# EAGLE design TSOC_GROVEY_WIFI_R0_9 (EAGLE 6.6.0)
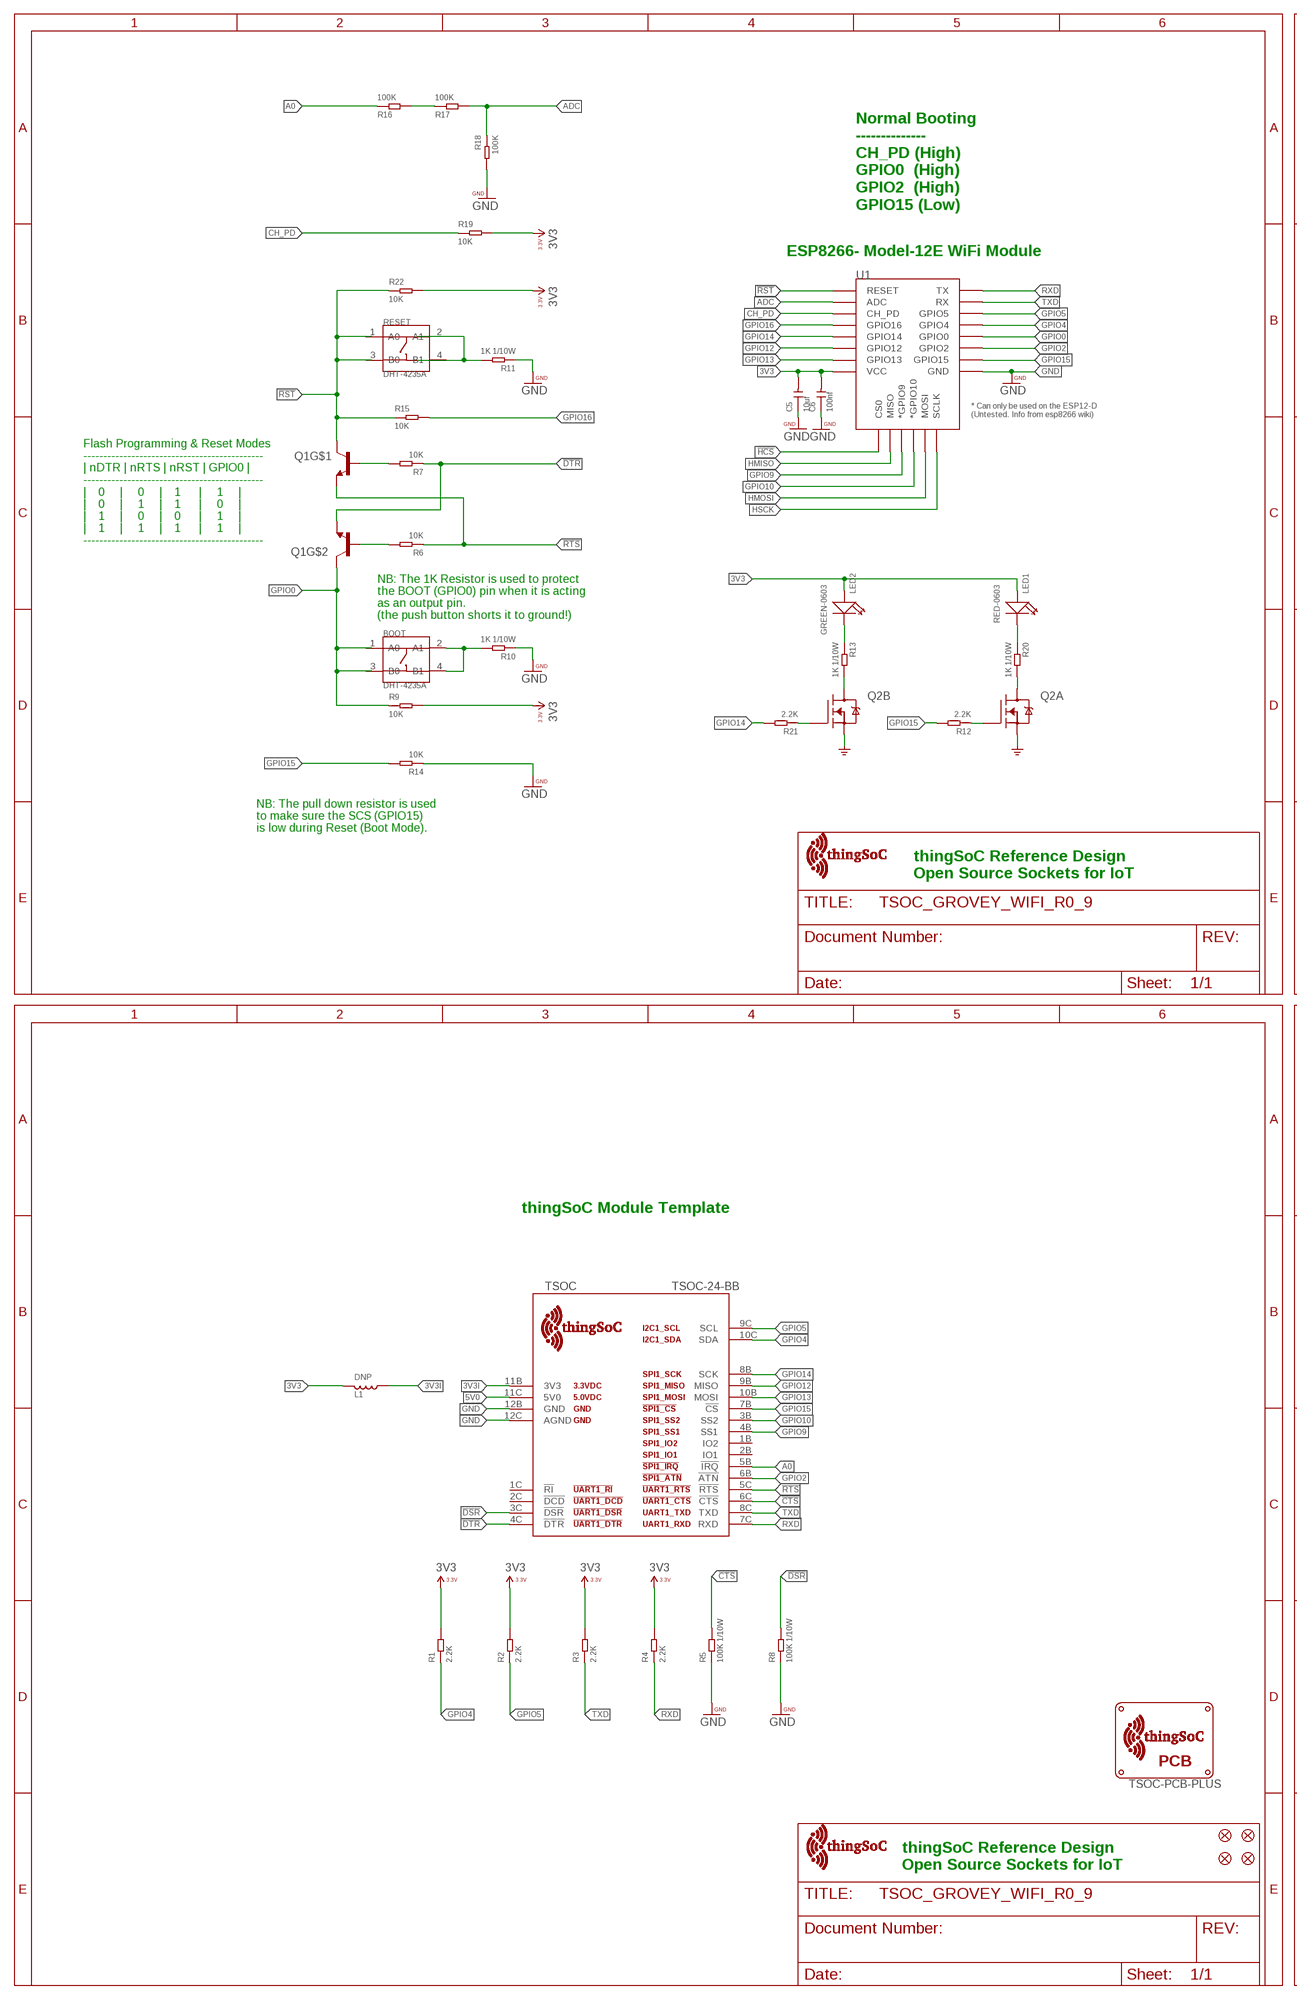
[diagram p0: schematic, sheet 1, part 1 of 2]
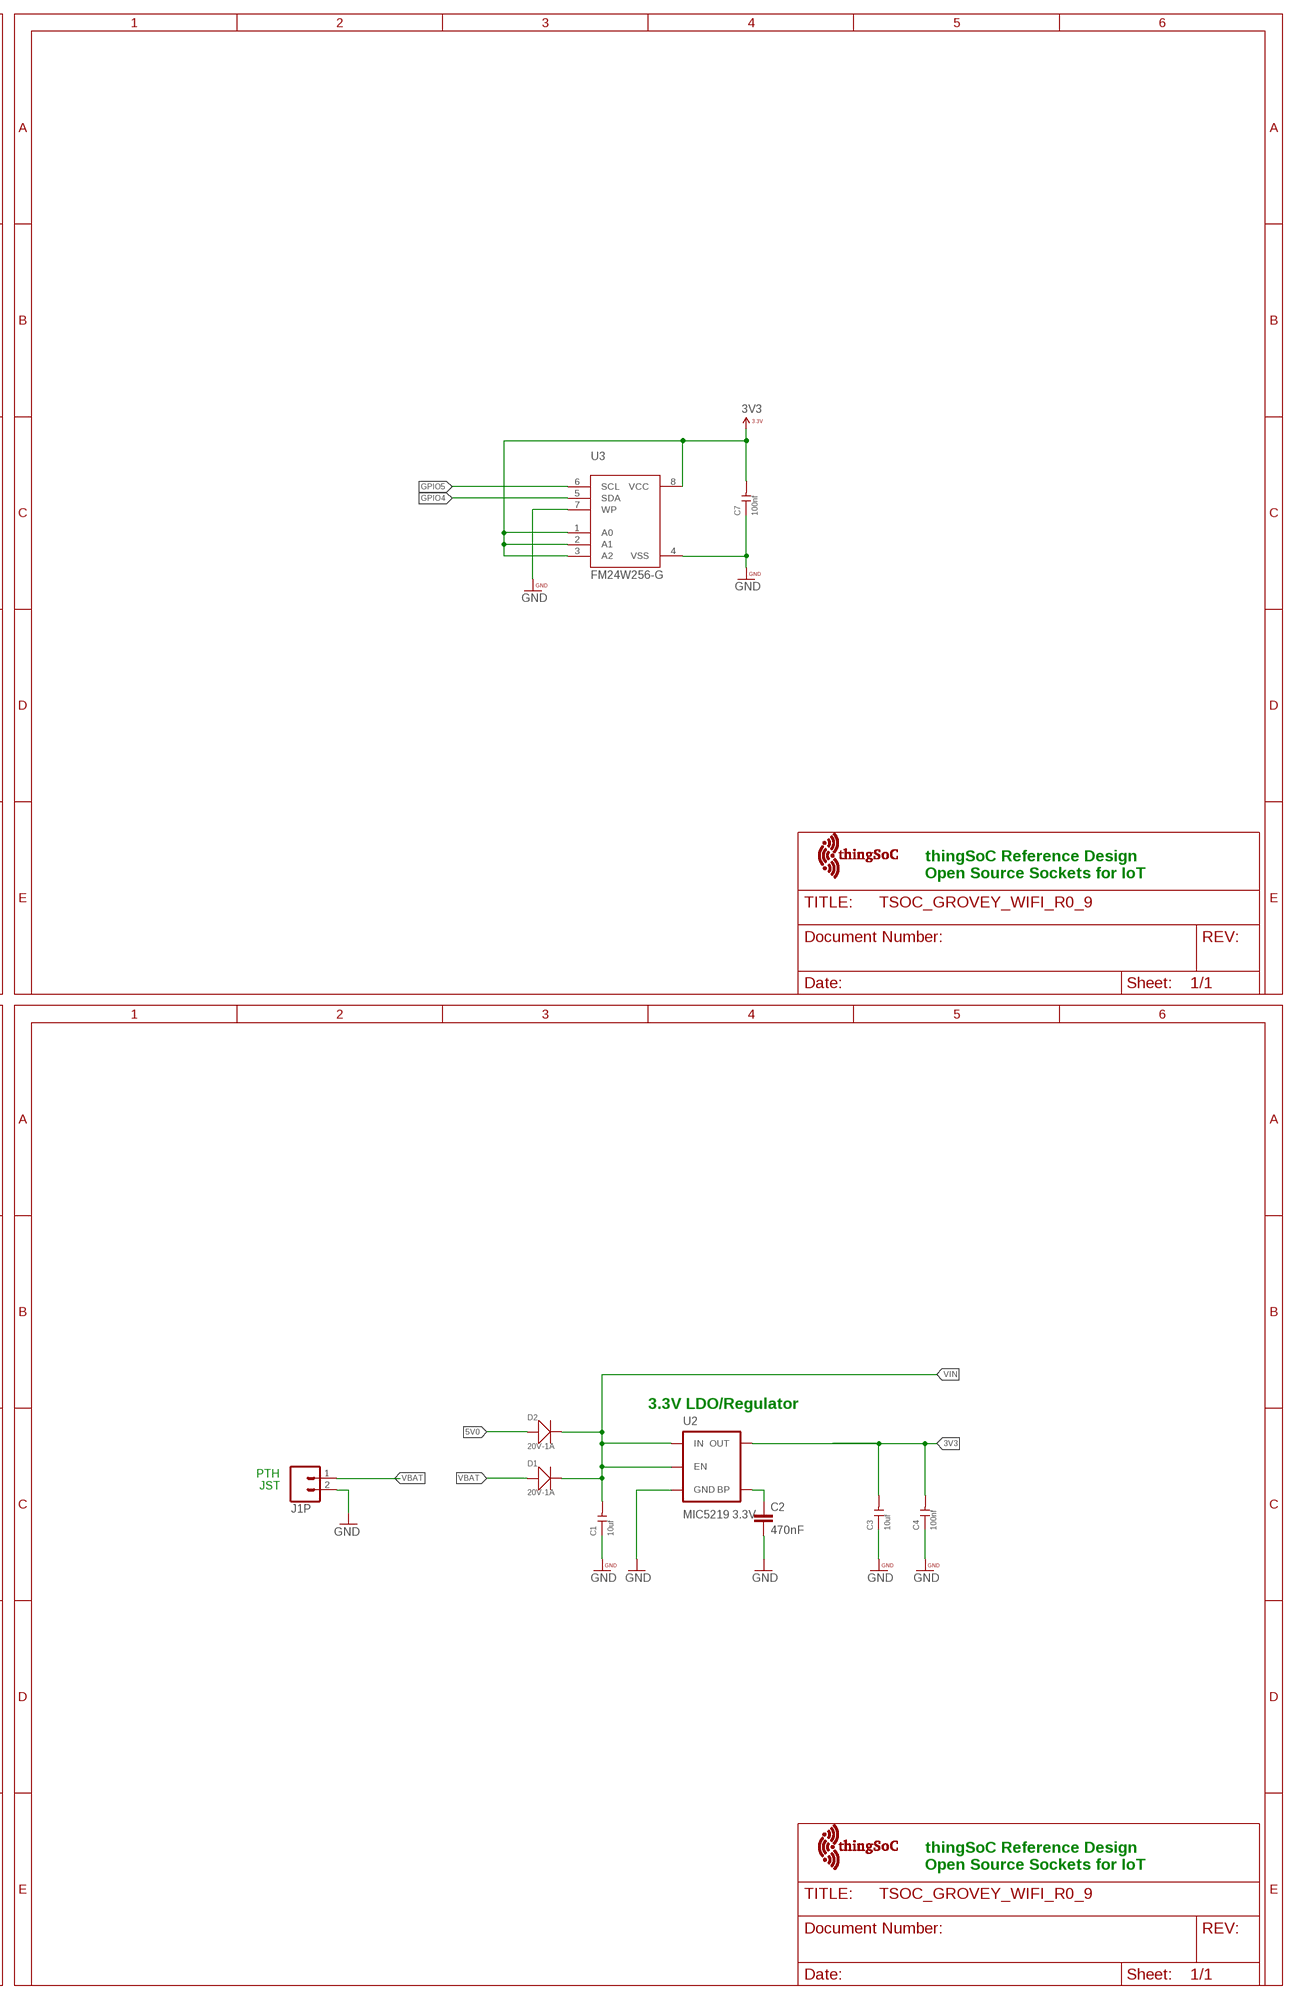
[diagram p1: schematic, sheet 1, part 2 of 2]

## Parts
BOOT  DHT-4235A  SMD-BUTTON-TOP-DHT-4235A(4P-4.2X3.2MM)  [SW4-SMD-4.2X3.2X2.5MM]
C1  10uf  CERAMIC-10UF-25V-10%-X5R(1206)  [C1206]
C2  470nF  CAP0402-CAP  [0402-CAP]
C3  10uf  CERAMIC-10UF-25V-10%-X5R(1206)  [C1206]
C4  100nf  CERAMIC-100NF-50V-10%-X7R(0603)  [C0603]
C5  10uf  CERAMIC-10UF-25V-10%-X5R(1206)  [C1206]
C6  100nf  CERAMIC-100NF-50V-10%-X7R(0603)  [C0603]
C7  100nf  CERAMIC-100NF-50V-10%-X7R(0603)  [C0603]
D1  20V-1A  SMD-DIODE-SCHOTTKY-20V-1A(SOD-123)  [SOD-123]
D2  20V-1A  SMD-DIODE-SCHOTTKY-20V-1A(SOD-123)  [SOD-123]
FID1  FIDUCIALUFIDUCIAL  [MICRO-FIDUCIAL]
FID2  FIDUCIALUFIDUCIAL  [MICRO-FIDUCIAL]
FID3  FIDUCIALUFIDUCIAL  [MICRO-FIDUCIAL]
FID4  FIDUCIALUFIDUCIAL  [MICRO-FIDUCIAL]
J1P  M02-JST-2-PTH-NO_SILK  [JST-2-PTH-NS]
L1  DNP  SMD-FERRITE-CHIP-120-OHM-500MA(0603)  [L0603]
LED1  RED-0603  LED-SMD-RED-DIFFUSED(0603)  [LED-0603]
LED2  GREEN-0603  SMD-LED-CLEAR-GREEN(0603)  [LED-0603]
PCB  TSOC-PCB-PLUS  [TSOC-BB-BRD-PLUS-DIM]
Q1  MMBT2222A  MMDT3904  [SOT363]
Q2  FDG1024NZ  [SOT95P280X110-6N]
R1  2.2K  SMD-RES-2.2K-5%-1/10W(0603)  [R0603]
R2  2.2K  SMD-RES-2.2K-5%-1/10W(0603)  [R0603]
R3  2.2K  SMD-RES-2.2K-5%-1/10W(0603)  [R0603]
R4  2.2K  SMD-RES-2.2K-5%-1/10W(0603)  [R0603]
R5  100K 1/10W  SMD-RES-100K-5%-1/10W(0603)  [R0603]
R6  10K  SMD-RES-10K-1%-1/10W(0603)  [R0603]
R7  10K  SMD-RES-10K-1%-1/10W(0603)  [R0603]
R8  100K 1/10W  SMD-RES-100K-5%-1/10W(0603)  [R0603]
R9  10K  SMD-RES-10K-1%-1/10W(0603)  [R0603]
R10  1K 1/10W  SMD-RES-1K-5%-1/10W(0603)  [R0603]
R11  1K 1/10W  SMD-RES-1K-5%-1/10W(0603)  [R0603]
R12  2.2K  SMD-RES-2.2K-5%-1/10W(0603)  [R0603]
R13  1K 1/10W  SMD-RES-1K-5%-1/10W(0603)  [R0603]
R14  10K  SMD-RES-10K-1%-1/10W(0603)  [R0603]
R15  10K  SMD-RES-10K-1%-1/10W(0603)  [R0603]
R16  100K  SMD-RES-100K-1%-1/10W(0603)  [R0603]
R17  100K  SMD-RES-100K-1%-1/10W(0603)  [R0603]
R18  100K  SMD-RES-100K-1%-1/10W(0603)  [R0603]
R19  10K  SMD-RES-10K-1%-1/10W(0603)  [R0603]
R20  1K 1/10W  SMD-RES-1K-5%-1/10W(0603)  [R0603]
R21  2.2K  SMD-RES-2.2K-5%-1/10W(0603)  [R0603]
R22  10K  SMD-RES-10K-1%-1/10W(0603)  [R0603]
RESET  DHT-4235A  SMD-BUTTON-TOP-DHT-4235A(4P-4.2X3.2MM)  [SW4-SMD-4.2X3.2X2.5MM]
TSOC  TSOC-24-BB  [TSOC-BB-S24]
U1  ESP12ESMD  [ESP12E-SMD]
U2  MIC5219 3.3V  V_REG_MIC52193.3V  [SOT23-5]
U3  FM24W256-G  [SO08]
U$22  TSOC-LOGO-MED  [TSOC-LOGO-MED]
U$23  TSOC-LOGO-MED  [TSOC-LOGO-MED]
U$26  TSOC-LOGO-MED  [TSOC-LOGO-MED]
U$28  TSOC-LOGO-MED  [TSOC-LOGO-MED]

## Nets
3V3: C3.2 C4.2 C5.2 C6.2 C7.2 L1.1 LED1.+ LED2.+ R1.2 R2.2 R3.2 R4.2 R9.2 R19.2 R22.2 U1.VCC U2.5(OUT) U3.1(A0) U3.2(A1) U3.3(A2) U3.8(VCC)
3V3I: L1.2 TSOC.11B(3V3)
5V0: D2.+ TSOC.11C(5V0)
!BOOTPD: BOOT.2(A1) BOOT.4(B1) R10.2
!CTS: R5.2 TSOC.6C(!CTS)
!DCDG: Q2.2(A:G) R12.1
!DSR: R8.2 TSOC.3C(!DSR)
!DTR: Q1.1(E) R7.1 TSOC.4C(!DTR)
!HCS: U1.CS0
!RST: Q1.3(C) R15.1 R22.1 RESET.1(A0) RESET.3(B0) U1.RESET
!RSTPD: R11.2 RESET.2(A1) RESET.4(B1)
!RTS: Q1.4(E) R6.1 TSOC.5C(!RTS)
!SCSG: Q2.5(B:G) R21.1
A0: R16.1 TSOC.5B(!IRQ)
ADC: R17.2 R18.1 U1.ADC
ADC2: R16.2 R17.1
BYPASS1: C2.1 U2.4(BP)
CH_PD: R19.1 U1.CH_PD
G0: Q2.6(A:D) R20.2
G15: Q2.3(B:D) R13.2
GND: C1.1 C2.2 C3.1 C4.1 C5.1 C6.1 C7.1 J1P.2 Q2.1(A:S) Q2.4(B:S) R5.1 R8.1 R10.1 R11.1 R14.1 R18.2 TSOC.12B(GND) TSOC.12C(AGND) U1.GND U2.2(GND) U3.4(VSS) U3.7(WP) ; supply symbol labelled GND_POWER
GPIO0: BOOT.1(A0) BOOT.3(B0) Q1.6(C) R9.1 U1.GPIO0
GPIO2: TSOC.6B(!ATN) U1.GPIO2
GPIO4: R1.1 TSOC.10C(SDA) U1.GPIO4 U3.5(SDA)
GPIO5: R2.1 TSOC.9C(SCL) U1.GPIO5 U3.6(SCL)
GPIO9: TSOC.4B(SS1) U1.GPIO9(*GPIO9)
GPIO10: TSOC.3B(SS2) U1.GPIO10(*GPIO10)
GPIO12: TSOC.9B(MISO) U1.GPIO12
GPIO13: TSOC.10B(MOSI) U1.GPIO13
GPIO14: R21.2 TSOC.8B(SCK) U1.GPIO14
GPIO15: R12.2 R14.2 TSOC.7B(!CS) U1.GPIO15
GPIO16: R15.2 U1.GPIO16
HMISO: U1.MISO
HMOSI: U1.MOSI
HSCK: U1.SCLK
LED1: LED2.- R13.1
LED2: LED1.- R20.1
RES: Q1.5(B) R7.2
ROS: Q1.2(B) R6.2
RXD: R4.1 TSOC.7C(RXD) U1.TXD0(TX)
TXD: R3.1 TSOC.8C(TXD) U1.RXD0(RX)
VBAT: D1.+ J1P.1
VIN: C1.2 D1.- D2.- U2.1(IN) U2.3(EN)
Unconnected: TSOC.1B(IO2) TSOC.1C(!RI) TSOC.2B(IO1) TSOC.2C(!DCD)

## Notes on the sheet
- Normal Booting
  --------------
  CH_PD (High)
  GPIO0  (High)
  GPIO2  (High) 
  GPIO15 (Low)
- ESP8266- Model-12E WiFi Module
- Flash Programming & Reset Modes
  ---------------------------------------------
  | nDTR | nRTS | nRST | GPIO0 |
  ---------------------------------------------
  |    0     |     0     |    1      |     1     |
  |    0     |     1     |    1      |     0     |
  |    1     |     0     |    0      |     1     |
  |    1     |     1     |    1      |     1     |
  ---------------------------------------------
- NB: The 1K Resistor is used to protect
  the BOOT (GPIO0) pin when it is acting
  as an output pin.
  (the push button shorts it to ground!)
- NB: The pull down resistor is used 
  to make sure the SCS (GPIO15)
  is low during Reset (Boot Mode).
- thingSoC Reference Design
  Open Source Sockets for IoT
- thingSoC Reference Design
  Open Source Sockets for IoT
- thingSoC Module Template
- 3.3V LDO/Regulator
- PTH
   JST
- thingSoC Reference Design
  Open Source Sockets for IoT
- thingSoC Reference Design
  Open Source Sockets for IoT

## Library data of the parts
BOOT RESET = TSOC_GROVEY_WIFI:SMD-BUTTON-TOP-DHT-4235A(4P-4.2X3.2MM): 311020045; MPN: DHT-4235A
C1 C3 C5 = Seeed-Capacitor-2016:CERAMIC-10UF-25V-10%-X5R(1206): 302010181; MPN: CC1206KKX5R8BB106
C2 = TSOC-ESP8266-BASE:CAP: Capacitor Standard 0603 ceramic capacitor, and 0.1" leaded capacitor.
C4 C6 C7 = Seeed-Capacitor-2016:CERAMIC-100NF-50V-10%-X7R(0603): 302010138; MPN: CC0603KRX7R9BB104
D1 D2 = Seeed-Diode-2016:SMD-DIODE-SCHOTTKY-20V-1A(SOD-123): 304020034; MPN: B5819W
FID1-FID4 = TSOC-ESP8266-BASE:FIDUCIAL: Fiducial Alignment Points Various fiducial points for machine vision alignment.
J1P = TSOC-ESP8266-BASE:M02: Standard 2-pin 0.1" header. Use with - straight break away headers ( PRT-00116) - right angle break away headers (PRT-00553) - swiss pins (PRT-00743) - machine pins (PRT-00117) - female headers (PRT-00115) Molex polarized connector foot print use with: PRT-08233 with associated crimp pins and housings. 2.54_SCREWTERM for use with PRT-10571. 3.5mm Screw Terminal footprints for PRT-08084 5mm Screw Terminal footprints for use with PRT-08432
L1 = Seeed-Inductor-2016:SMD-FERRITE-CHIP-120-OHM-500MA(0603): 303030001; MPN: BLM18AG121SN1D; VALUE: 120OHM-500MA
LED1 = Seeed-LED-2016:LED-SMD-RED-DIFFUSED(0603): 304090042; MPN: 19-217-R6C-AL1M2VY-3T
LED2 = Seeed-LED-2016:SMD-LED-CLEAR-GREEN(0603): 304090043; MPN: 19-217-G7C-AN1P2-3T
PCB = thingSoC:TSOC-PCB: thingSoC PCB Outlines Boards Outlines for Standard Sizes (in the DImension Layer) (Registration marks in the tDocu layer - make sure to turn on tDocu/bDocu) Source LBR : http://www.thingsoc.com Github : https://github.com/thingsoc License : http://creativecommons.org/licenses/by-sa/4.0/ (Creative Commons 4.0) THIS SOFTWARE IS PROVIDED BY THE CONTRIBUTORS "AS IS" AND WITHOUT ANY EXPRESS OR IMPLIED WARRANTIES, INCLUDING, BUT NOT LIMITED TO, THE IMPLIED WARRANTIES OF MERCHANTABILITY AND FITNESS FOR A PARTICULAR PURPOSE ARE DISCLAIMED. IN NO EVENT SHALL THE COPYRIGHT OWNER OR CONTRIBUTORS BE LIABLE FOR ANY DIRECT, INDIRECT, INCIDENTAL, SPECIAL, EXEMPLARY, OR CONSEQUENTIAL DAMAGES (INCLUDING, BUT NOT LIMITED TO, PROCUREMENT OF SUBSTITUTE GOODS OR SERVICES; LOSS OF USE, DATA, OR PROFITS; OR BUSINESS INTERRUPTION) HOWEVER CAUSED AND ON ANY THEORY OF LIABILITY, WHETHER IN CONTRACT, STRICT LIABILITY, OR TORT (INCLUDING NEGLIGENCE OR OTHERWISE) ARISING IN ANY WAY OUT OF THE USE OF THIS SOFTWARE, EVEN IF ADVISED OF THE POSSIBILITY OF SUCH DAMAGE.
Q1 = SparkFun-DiscreteSemi:MMDT3904: Dual NPN transistor
Q2 = PatternAgents-Fairchild:FDG1024NZ: FDG1024NZ Dual N-Channel PowerTrench® MOSFET 20 V, 1.2 A, 175 mΩ
R1-R4 R12 R21 = Seeed-Resistor-2016:SMD-RES-2.2K-5%-1/10W(0603): 301010124; MPN: RC0603JR-072K2L
R5 R8 = Seeed-Resistor-2016:SMD-RES-100K-5%-1/10W(0603): 301010089; MPN: RC0603JR-07100KL
R6 R7 R9 R14 R15 R19 R22 = Seeed-Resistor-2016:SMD-RES-10K-1%-1/10W(0603): 301010299; MPN: RC0603FR-0710KL
R10 R11 R13 R20 = Seeed-Resistor-2016:SMD-RES-1K-5%-1/10W(0603): 301010291; MPN: RC0603JR-071KL
R16-R18 = Seeed-Resistor-2016:SMD-RES-100K-1%-1/10W(0603): 301010196; MPN: RC0603FR-07100KL
TSOC = thingSoC:TSOC-24: thingSoC Twenty-Four(24) Pin Socket Source LBR : http://www.thingsoc.com Github : https://github.com/thingsoc License : http://creativecommons.org/licenses/by-sa/4.0/ (Creative Commons 4.0) THIS SOFTWARE IS PROVIDED BY THE CONTRIBUTORS "AS IS" AND WITHOUT ANY EXPRESS OR IMPLIED WARRANTIES, INCLUDING, BUT NOT LIMITED TO, THE IMPLIED WARRANTIES OF MERCHANTABILITY AND FITNESS FOR A PARTICULAR PURPOSE ARE DISCLAIMED. IN NO EVENT SHALL THE COPYRIGHT OWNER OR CONTRIBUTORS BE LIABLE FOR ANY DIRECT, INDIRECT, INCIDENTAL, SPECIAL, EXEMPLARY, OR CONSEQUENTIAL DAMAGES (INCLUDING, BUT NOT LIMITED TO, PROCUREMENT OF SUBSTITUTE GOODS OR SERVICES; LOSS OF USE, DATA, OR PROFITS; OR BUSINESS INTERRUPTION) HOWEVER CAUSED AND ON ANY THEORY OF LIABILITY, WHETHER IN CONTRACT, STRICT LIABILITY, OR TORT (INCLUDING NEGLIGENCE OR OTHERWISE) ARISING IN ANY WAY OUT OF THE USE OF THIS SOFTWARE, EVEN IF ADVISED OF THE POSSIBILITY OF SUCH DAMAGE.
U1 = PatternAgents_RFmodules:ESP12E: ESP12E Module
U2 = TSOC-ESP8266-BASE:V_REG_MIC5219: V_REG MIC5219 Standard 3.3V and 5V 500mA LDO voltage regulator in SOT-23 layout. Micrel part MIC5219. BP (by-pass) pin is used to lower output noise with 470pF cap, may be left open.; PROD_ID: VREG-09872
U3 = PatternAgents-Cypress:FM24W256: I2C FRAM FM24W256
U$22 U$23 U$26 U$28 = thingSoC:TSOC-LOGO: thingSoC Logo Source LBR : http://www.thingsoc.com Github : https://github.com/thingsoc License : http://creativecommons.org/licenses/by-sa/4.0/ (Creative Commons 4.0) THIS SOFTWARE IS PROVIDED BY THE CONTRIBUTORS "AS IS" AND WITHOUT ANY EXPRESS OR IMPLIED WARRANTIES, INCLUDING, BUT NOT LIMITED TO, THE IMPLIED WARRANTIES OF MERCHANTABILITY AND FITNESS FOR A PARTICULAR PURPOSE ARE DISCLAIMED. IN NO EVENT SHALL THE COPYRIGHT OWNER OR CONTRIBUTORS BE LIABLE FOR ANY DIRECT, INDIRECT, INCIDENTAL, SPECIAL, EXEMPLARY, OR CONSEQUENTIAL DAMAGES (INCLUDING, BUT NOT LIMITED TO, PROCUREMENT OF SUBSTITUTE GOODS OR SERVICES; LOSS OF USE, DATA, OR PROFITS; OR BUSINESS INTERRUPTION) HOWEVER CAUSED AND ON ANY THEORY OF LIABILITY, WHETHER IN CONTRACT, STRICT LIABILITY, OR TORT (INCLUDING NEGLIGENCE OR OTHERWISE) ARISING IN ANY WAY OUT OF THE USE OF THIS SOFTWARE, EVEN IF ADVISED OF THE POSSIBILITY OF SUCH DAMAGE.

## Net classes
1 vcc: width 0.254 mm

## Board
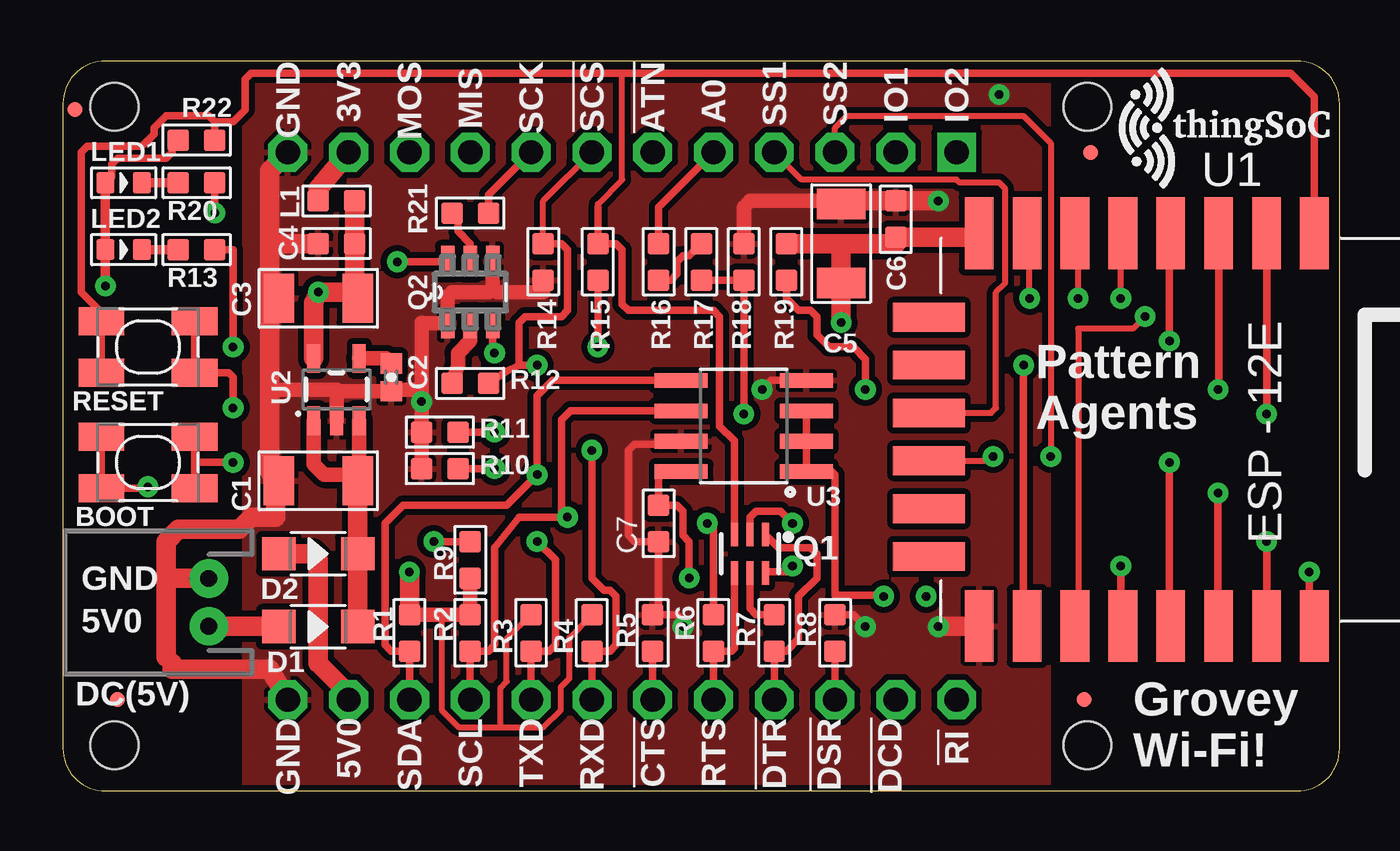
[diagram p2: board, top side]
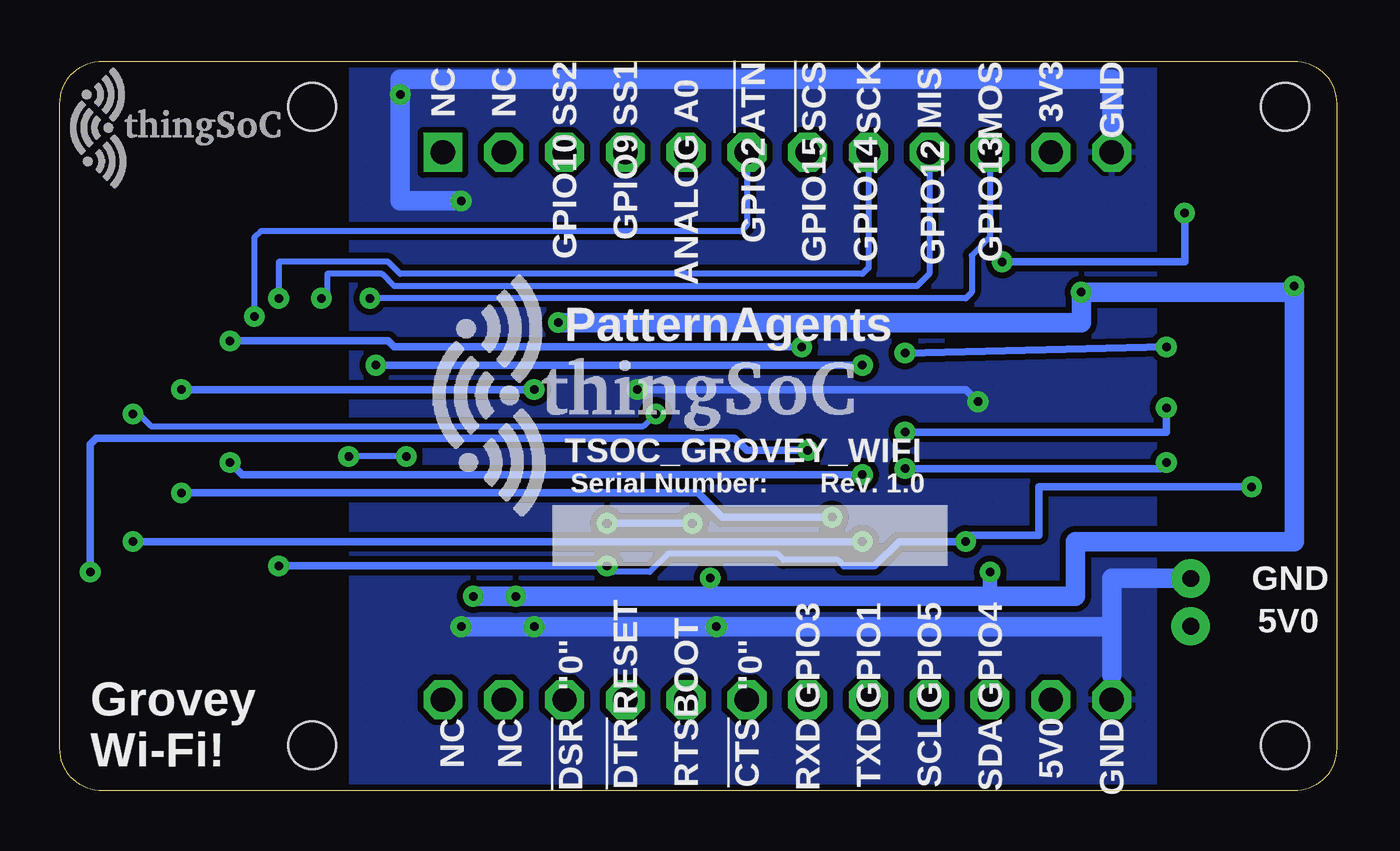
[diagram p3: board, bottom side, seen from below]

Size 53.34 x 30.48 mm. Coordinates in mm from the lower left corner, seen from the top.
Copper layers (1*16): Top 0.035mm / dielectric 1.5mm / Bottom 0.035mm
Design rules "PatternAgents_7mil": minimum track width 7mil, minimum drill 14mil, track to track 7mil, track to pad 7mil, pad to pad 7mil, via to via 7mil, smd to smd 7mil, copper to edge 7mil, drill to drill 7mil, minimum pad ring 12mil, minimum via ring 10mil, stop-mask expansion 4mil, vias tented up to drill 25mil, thermal gap 7mil

### Footprints (pad centres in the part's own frame; a part is rotated, then mirrored left to right if it is on the bottom)
SW4-SMD-4.2X3.2X2.5MM = smd 1.905 x 1.168: 1 -1.95,1.075; 2 1.95,1.075; 3 -1.95,-1.075; 4 1.95,-1.075
C1206 = smd 1.27 x 2.032: 1 -1.651,0; 2 1.651,0
0402-CAP = smd 0.85 x 0.9: 1 -0.58,0; 2 0.58,0
C0603 = smd 0.889 x 0.889: 1 0,0.762; 2 0,-0.762
SOD-123 = smd 1.397 x 1.397: + -1.651,0; - 1.651,0
MICRO-FIDUCIAL = smd 0.635 x 0.635: 1 0,0
JST-2-PTH-NS = drill 0.7 pad 1.6: 1 -1,0; 2 1,0
L0603 = smd 0.889 x 0.889: 1 -0.762,0; 2 0.762,0
LED-0603 = smd 0.762 x 0.889: + -0.762,0; - 0.762,0
TSOC-BB-BRD-PLUS-DIM = hole 2: -13.335,-23.749; 13.335,-23.749; -13.335,16.891; 13.335,16.891
SOT363 = smd 0.3 x 0.99: 1 -0.65,-0.8; 2 0,-0.8; 3 0.65,-0.8; 4 0.65,0.81; 5 0,0.81; 6 -0.65,0.81
SOT95P280X110-6N = smd 1.27 x 0.559: 1 -1.295,0.94; 2 -1.295,0; 3 -1.295,-0.94; 4 1.295,-0.94; 5 1.295,0; 6 1.295,0.94
R0603 = smd 0.889 x 0.889: 1 0,0.762; 2 0,-0.762
TSOC-BB-S24 = drill 1.016 square: 1B -11.43,11.43 | drill 1.016 octagon: 1C 11.43,11.43; 2B -11.43,8.89; 2C 11.43,8.89; 3B -11.43,6.35; 3C 11.43,6.35; 4B -11.43,3.81; 4C 11.43,3.81; 5B -11.43,1.27; 5C 11.43,1.27; 6B -11.43,-1.27; 6C 11.43,-1.27; 7B -11.43,-3.81; 7C 11.43,-3.81; 8B -11.43,-6.35; 8C 11.43,-6.35; 9B -11.43,-8.89; 9C 11.43,-8.89; 10B -11.43,-11.43; 10C 11.43,-11.43; 11B -11.43,-13.97; 11C 11.43,-13.97; 12B -11.43,-16.51; 12C 11.43,-16.51
ESP12E-SMD = smd 3 x 1.2: ADC -8.3,3.8; CH_PD -8.3,1.8; GND 8.1,-8.2; GPIO0 8.1,-2.2; GPIO2 8.1,-4.2; GPIO4 8.1,-0.2; GPIO5 8.1,1.8; GPIO12 -8.3,-4.2; GPIO13 -8.3,-6.2; GPIO14 -8.3,-2.2; GPIO15 8.1,-6.2; GPIO16 -8.3,-0.2; RESET -8.3,5.8; RXD0 8.1,3.8; TXD0 8.1,5.8; VCC -8.3,-8.2 | smd 1.2 x 3: CS0 -4.8,-10.3; GPIO9 -0.8,-10.3; GPIO10 1.2,-10.3; MISO -2.8,-10.3; MOSI 3.2,-10.3; SCLK 5.2,-10.3
SOT23-5 = smd 0.55 x 1.2: 1 -0.95,-1.3; 2 0,-1.3; 3 0.95,-1.3; 4 0.95,1.3; 5 -0.95,1.3
SO08 = smd 0.61 x 2.21: 1 -1.905,-2.616; 2 -0.635,-2.616; 3 0.635,-2.616; 4 1.905,-2.616; 5 1.905,2.616; 6 0.635,2.616; 7 -0.635,2.616; 8 -1.905,2.616

### Placement (x,y rotation side)
BOOT  3.56,13.72 0 top
C1  10.67,12.95 0 top
C2  13.72,17.27 270 top
C3  10.67,20.57 0 top
C4  11.43,22.86 90 top
C5  32.51,22.86 270 top
C6  34.8,23.88 0 top
C7  24.89,11.18 180 top
D1  10.67,6.86 0 top
D2  10.67,9.91 0 top
FID1  2.29,3.81 0 top
FID2  42.67,3.81 0 top
FID3  42.93,26.67 0 top
FID4  0.51,28.45 0 top
J1P  6.1,7.87 90 top
L1  11.43,24.64 180 top
LED1  2.54,25.4 0 top
LED2  2.54,22.61 0 top
PCB  25.91,15.24 270 top
Q1  28.7,9.91 180 top
Q2  17.02,20.83 90 top
R1  14.48,6.6 180 top
R2  17.02,6.6 180 top
R3  19.56,6.6 180 top
R4  22.1,6.6 180 top
R5  24.64,6.6 0 top
R6  27.18,6.6 180 top
R7  29.72,6.6 180 top
R8  32.26,6.6 0 top
R9  17.02,9.65 0 top
R10  15.75,13.46 90 top
R11  15.75,14.99 90 top
R12  17.02,17.02 90 top
R13  5.59,22.61 90 top
R14  20.07,22.1 180 top
R15  22.35,22.1 0 top
R16  24.89,22.1 0 top
R17  26.67,22.1 0 top
R18  28.45,22.1 180 top
R19  30.23,22.1 180 top
R20  5.59,25.4 90 top
R21  17.02,24.13 90 top
R22  5.59,27.18 270 top
RESET  3.56,18.54 0 top
TSOC  25.91,15.24 270 top
U1  46.48,14.99 270 top
U2  11.43,16.76 0 top
U3  28.45,15.24 90 top
U$22  51.31,27.69 0 bottom
U$23  51.31,27.69 0 bottom
U$26  45.72,27.69 0 top
U$28  45.72,27.69 0 top
U$101  TSOC-LOGO-LRG  [TSOC-LOGO-LRG]  34.54,16.51 0 bottom

### Tracks (layer width: path | path; a pad name or v marks a point on that pad's centre or on a via)
3V3  (via drill 0.36)
  Top 0.178: 19.56,7.29 R3.2 | 22.05,7.29 R4.2 | 31.11,13.34 U3.1
  Top 0.254: 15.82,7.37 15.82,3.38 16.54,2.67 18.29,2.67 | 22.05,7.29 21.16,6.4 21.16,4.7 20.8,4.34 20.8,3.38 20.09,2.67 18.29,2.67 | 19.56,7.29 19.48,7.29 | 18.29,2.67 18.29,4.32 18.54,4.57 18.54,6.35 R3.2
  Top 0.305: LED1.+ 2.03,25.65 2.03,26.16 2.29,26.42 4.32,26.42 4.57,26.67 4.57,26.92 R22.2 | U3.8 25.15,13.34 24.89,13.08 C7.2 25.65,11.94 25.91,11.68 25.91,10.67 26.16,10.41 v26.16,8.89 | U3.3 U3.2 U3.1 31.19,13.46 32,13.46 32.26,13.21 32.26,8.18 34.24,8.18 v34.29,8.13
  Top 0.406: LED1.+ LED2.+ v1.78,21.08
  Top 0.61: R1.2 15.82,7.37 R2.2 R9.2
  Top 0.813: L1.1 C4.2 12.19,20.95 C3.2 12.32,20.7 12.19,20.83 v10.67,20.83 10.48,20.39 U2.5 | 32.51,22.86 C5.2 v32.51,19.56 | 32.51,22.86 34.8,22.86 C6.2 38.11,23.11 U1.VCC | R19.2 32.51,22.86 | v14.48,9.14 R1.2
  Bottom 0.178: 2.13,20.83 2.13,20.8 1.78,20.8
  Bottom 0.61: v14.48,9.14 14.48,8.13 | v26.16,8.89 26.16,8.13
  Bottom 0.813: 1.78,20.83 2.13,20.83 v10.67,20.83 10.67,19.56 v32.51,19.56 | v1.78,21.08 1.78,20.8 1.78,10.41 10.92,10.41 10.92,8.13 14.48,8.13 26.16,8.13 v34.29,8.13 v36.07,8.13
3V3I
  Top 0.813: L1.2 10.67,25.15 TSOC.11B
5V0
  Top 0.813: TSOC.11C 11.94,4.06 10.67,5.33 10.67,9.65 10.41,9.91 D2.+
!BOOTPD  (via drill 0.36)
  Top 0.305: R10.2 v18.03,13.46 | 5.59,12.72 BOOT.4 5.51,13.72 | BOOT.2 5.51,13.72 | v7.11,13.72 5.51,13.72
  Bottom 0.305: v18.03,13.46 7.37,13.46 v7.11,13.72
!CTS
  Top 0.305: R5.2 TSOC.6C
!DCDG
  Top 0.61: Q2.2 17.02,18.8 16.51,18.29 16.51,17.78 R12.1
!DSR
  Top 0.305: R8.2 TSOC.3C
!DTR
  Top 0.305: TSOC.4C R7.1 30.23,5.84 30.73,6.35 30.73,8.13 31.5,8.89 31.5,9.91 31.24,10.16 29.9,10.16 Q1.1
!RST
  Top 0.254: 22.35,24.38 22.35,24.51 23.37,25.53 23.37,29.97
  Top 0.305: RESET.3 RESET.1 1.61,19.98 0.76,20.83 0.76,26.67 1.02,26.92 3.3,26.92 3.81,27.43 3.81,27.69 4.32,28.19 6.1,28.19 6.35,27.94 | 52.32,23.33 U1.RESET 52.28,29 51.31,29.97 23.37,29.97 7.87,29.97 7.62,29.72 7.62,28.45 7.11,27.94 6.35,27.94 | 6.35,27.94 R22.1 | 22.35,24.38 R15.1 23.11,22.86 23.37,22.61 23.37,20.32 23.62,20.07 27.18,20.07 27.43,19.81 27.43,15.24 28.05,14.62 Q1.3
!RSTPD  (via drill 0.36)
  Top 0.305: RESET.2 RESET.4 6.92,17.47 7.11,17.27 v7.11,16 | R11.2 v18.03,14.99
  Bottom 0.305: v18.03,14.99 7.11,14.99 v7.11,16
!RTS
  Top 0.305: TSOC.5C R6.1 27.94,5.84 28.05,5.95 Q1.4
!SCSG
  Top 0.305: Q2.5 17.02,22.86 16.51,23.37 16.51,23.88 R21.1
A0
  Top 0.305: R16.1 24.89,24.38 TSOC.5B
ADC  (via drill 0.36)
  Top 0.305: R17.2 R18.1 v28.45,15.75 | v50.29,15.75 50.29,23.28 U1.ADC
  Bottom 0.254: v50.29,15.75 50.04,15.75 49.53,15.24 28.96,15.24 v28.45,15.75
ADC2
  Top 0.305: R16.2 25.4,21.34 25.65,21.59 25.65,22.1 25.91,22.35 26.16,22.35 R17.1
BYPASS1
  Top 0.61: U2.4 13.5,18.06 C2.1
CH_PD  (via drill 0.36)
  Top 0.305: U1.CH_PD 48.28,17.04 v48.26,16.76 | R19.1 30.23,20.57 30.73,20.07 31.24,20.07 31.5,19.81 31.5,19.05 32,18.54 33.02,18.54 33.53,18.03 v33.53,16.76
  Bottom 0.305: v48.26,16.76 v33.53,16.76
G0  (via drill 0.36)
  Top 0.305: R20.2 v6.35,24.13 | v13.97,22.1 16.05,22.1 Q2.6
  Bottom 0.305: v13.97,22.1 6.35,22.1 v6.35,24.13
G15  (via drill 0.36)
  Top 0.305: Q2.3 17.96,18.62 v18.03,18.29 | v7.11,18.54 7.11,22.61 R13.2
  Bottom 0.305: v18.03,18.29 v7.11,18.54
GND  (via drill 0.36)
  Top 0.305: R8.1 33.02,7.37 v33.53,6.86 | v25.91,6.86 25.91,7.11 25.65,7.37 R5.1 24.89,7.62 C7.1 23.88,10.41 23.62,10.67 23.62,14.22 23.88,14.48 25.7,14.48 U3.7 | v14.99,16.26 14.99,18.8 | U3.4 29.59,17.14 v29.21,16.76
  Top 0.61: U2.2 11.43,16.51 | 11.43,16.51 11.43,16.76 8.89,16.76 8.64,17.02 | 11.43,16.51 11.61,16.69 C2.2 13.79,16.76 14.99,16.76 | 14.99,16.76 14.99,18.8 14.99,19.56 15.01,19.53 Q2.1 16.08,20.65 16.26,20.83 17.78,20.83 17.96,21.01 | Q2.4 17.96,21.01 | 14.99,16.76 v14.99,16.26 R11.1 R10.1 | R14.1 20.07,20.83 18.14,20.83 17.96,21.01 | R18.2 28.45,24.38 28.7,24.64 32.38,24.64 C5.1
  Top 0.813: TSOC.12B 8.64,25.91 8.64,22.86 | TSOC.12C 8.64,5.08 4.57,5.08 4.57,5.33 4.32,5.59 4.32,8.89 | U1.GND 36.6,6.89 v36.58,6.86 | 4.32,8.89 4.32,10.41 4.83,10.92 7.37,10.92 7.87,11.43 8.89,11.43 8.89,12.83 C1.1 8.64,13.34 8.64,17.02 8.64,20.57 | 4.32,8.89 6.08,8.89 J1P.2 | C4.1 8.64,22.86 | C5.1 32.64,24.64 C6.1 v36.58,24.64 | 8.64,22.86 8.64,20.57 | C3.1 8.64,20.57
  Bottom 0.305: v29.21,16.76 15.49,16.76 v14.99,16.26
  Bottom 0.813: v36.58,6.86 v33.53,6.86 v25.91,6.86 9.4,6.86 | 9.4,6.86 9.4,4.83 | J1P.2 9.38,8.87 9.4,8.89 9.4,6.86 | TSOC.12B 9.4,29.72 39.12,29.72 v39.12,29.08 39.12,24.64 v36.58,24.64
  pour Bottom (isolate 0.254, hatched): 7.62,0 7.62,30.48 41.15,30.48 41.15,0
  pour Top (isolate 0.254, hatched): 7.62,0 7.62,30.48 41.15,30.48 41.15,0
GPIO0  (via drill 0.36)
  Top 0.305: BOOT.1 BOOT.3 3.5,12.64 v3.56,12.7 | v44.2,9.4 44.2,6.97 U1.GPIO0 | Q1.6 29.4,9.14 30.23,9.14 v30.48,9.4 | v15.49,10.41 R9.1
  Bottom 0.254: 20.57,9.4 20.83,9.65 23.11,9.65 23.37,9.91 27.94,9.91 28.7,9.14 30.23,9.14 v30.48,9.4
  Bottom 0.305: v3.56,12.7 12.45,12.7 12.45,10.67 15.24,10.67 v15.49,10.41 18.29,10.41 19.3,9.4 20.57,9.4 | v44.2,9.4 v30.48,9.4
GPIO2  (via drill 0.36)
  Top 0.254: v45.21,19.81 44.7,19.3 42.42,19.3 42.42,7.02 U1.GPIO2
  Bottom 0.254: TSOC.6B 24.64,23.62 24.89,23.37 44.96,23.37 45.21,23.11 v45.21,19.81
GPIO4  (via drill 0.36)
  Top 0.305: TSOC.10C R1.1 13.72,5.84 13.46,6.1 13.46,11.18 14.22,11.94 18.54,11.94 v19.81,13.21 19.81,16.51 20.45,17.14 U3.5 | v46.23,13.72 46.23,6.94 U1.GPIO4
  Bottom 0.305: v19.81,13.21 45.72,13.21 v46.23,13.72
GPIO5  (via drill 0.36)
  Top 0.305: TSOC.9C R2.1 17.78,5.84 18.03,6.1 18.03,10.16 19.05,11.43 v21.08,11.43 20.83,11.68 20.83,15.49 21.21,15.88 U3.6 | v48.26,12.45 48.26,6.91 U1.GPIO5
  Bottom 0.305: v21.08,11.43 25.65,11.43 26.67,12.45 v48.26,12.45
GPIO9
  Top 0.254: U1.GPIO9 38.77,15.79 38.99,16 38.99,20.83 39.37,21.21 39.37,25.15 39.12,25.4 37.47,25.4 37.34,25.53 30.86,25.53 TSOC.4B
GPIO10  (via drill 0.36)
  Top 0.254: U1.GPIO10 38.68,13.79 v38.86,13.97 | TSOC.3B 32.26,27.69 32.77,28.19 40.13,28.19 41.27,27.05 v41.27,13.97
  Bottom 0.254: v38.86,13.97 v41.27,13.97
GPIO12  (via drill 0.36)
  Top 0.254: v42.42,20.57 42.42,23.15 U1.GPIO12
  Bottom 0.254: TSOC.9B 17.02,21.59 17.53,21.08 39.37,21.08 39.88,21.59 42.16,21.59 42.16,20.83 v42.42,20.57
GPIO13  (via drill 0.36)
  Top 0.254: v40.39,20.57 40.39,23.18 U1.GPIO13
  Bottom 0.254: TSOC.10B 14.48,23.11 15.24,22.35 15.24,20.83 15.49,20.57 v40.39,20.57
GPIO14  (via drill 0.36)
  Top 0.254: v44.2,20.57 44.2,23.2 U1.GPIO14
  Top 0.305: R21.2 17.78,24.89 TSOC.8B
  Bottom 0.254: TSOC.8B 19.56,21.84 19.81,21.59 39.12,21.59 39.62,22.1 44.2,22.1 v44.2,20.57
GPIO15  (via drill 0.36)
  Top 0.254: R14.2 20.07,24.64 TSOC.7B
  Top 0.305: R12.2 18.54,17.53 19.05,17.78 | R14.2 20.83,22.86 21.08,22.61 21.08,20.07 20.83,19.81 19.3,19.81 19.05,19.56 19.05,17.78 | 19.05,17.78 v19.81,17.78 | v40.13,17.78 40.13,7.04 U1.GPIO15
  Bottom 0.305: v19.81,17.78 v40.13,17.78
GPIO16  (via drill 0.36)
  Top 0.305: R15.2 v22.35,18.54 | v46.23,18.8 46.23,23.23 U1.GPIO16
  Bottom 0.305: v22.35,18.54 39.37,18.54 39.62,18.8 v46.23,18.8
LED1
  Top 0.406: R13.1 LED2.-
LED2
  Top 0.406: LED1.- R20.1
RES
  Top 0.305: Q1.5 28.7,7.62 28.96,7.37 R7.2
ROS  (via drill 0.36)
  Top 0.305: R6.2 27.18,11.18 v26.92,11.18 | v30.48,11.18 29.97,11.68 28.96,11.68 28.7,11.43 Q1.2
  Bottom 0.305: v26.92,11.18 v30.48,11.18
RXD  (via drill 0.36)
  Top 0.305: v52.07,9.14 52.07,7.1 U1.TXD0 | TSOC.7C R4.1 22.86,5.84 23.11,6.1 23.11,8.13 22.86,8.38 22.61,8.38 22.1,8.89 v22.1,14.22
  Bottom 0.305: v22.1,14.22 24.64,14.22 25.15,14.73 51.82,14.73 52.07,14.48 v52.07,9.14
TXD  (via drill 0.36)
  Top 0.305: v50.29,10.41 50.29,6.9 U1.RXD0 | TSOC.8C R3.1 20.32,5.84 20.57,6.1 20.57,9.65 v19.81,10.41
  Bottom 0.305: v19.81,10.41 v50.29,10.41
VBAT
  Top 0.813: J1P.1 9.02,6.87 D1.+
VIN
  Top 0.61: U2.3 12.38,13.02 C1.2 12.06,13.21 10.92,13.21 10.48,13.65 U2.1
  Top 0.813: D1.- D2.- C1.2

### Text on the board
tPlace: GND | 3V3 | MOS | MIS | SCK | !SCS | !ATN | A0 | SS1 | SS2 | IO1 | IO2 | RESET | Pattern / Agents | BOOT | Q1 | GND | 5V0 | DC(5V) | GND | 5V0 | SDA | SCL | TXD | RXD | !CTS | RTS | !DTR | !DSR | !DCD | !RI | Grovey / Wi-Fi!
bPlace: GND | 3V3 | MOS | MIS | SCK | !SCS | !ATN | A0 | SS1 | SS2 | NC | NC | GPIO13 | GPIO12 | GPIO14 | GPIO15 | GPIO2 | ANALOG | GPIO9 | GPIO10 | PatternAgents | TSOC_GROVEY_WIFI | Rev. 1.0 | Serial Number: | GND | GPIO4 | GPIO5 | GPIO1 | GPIO3 | RESET | 5V0 | BOOT | "0" | "0" | GND | 5V0 | SDA | SCL | TXD | RXD | !CTS | RTS | !DTR | !DSR | NC | NC | Grovey / Wi-Fi!